# EasyEDA Pro project NFC1扩展板挖宝.eprj

# Board NFC1扩展板
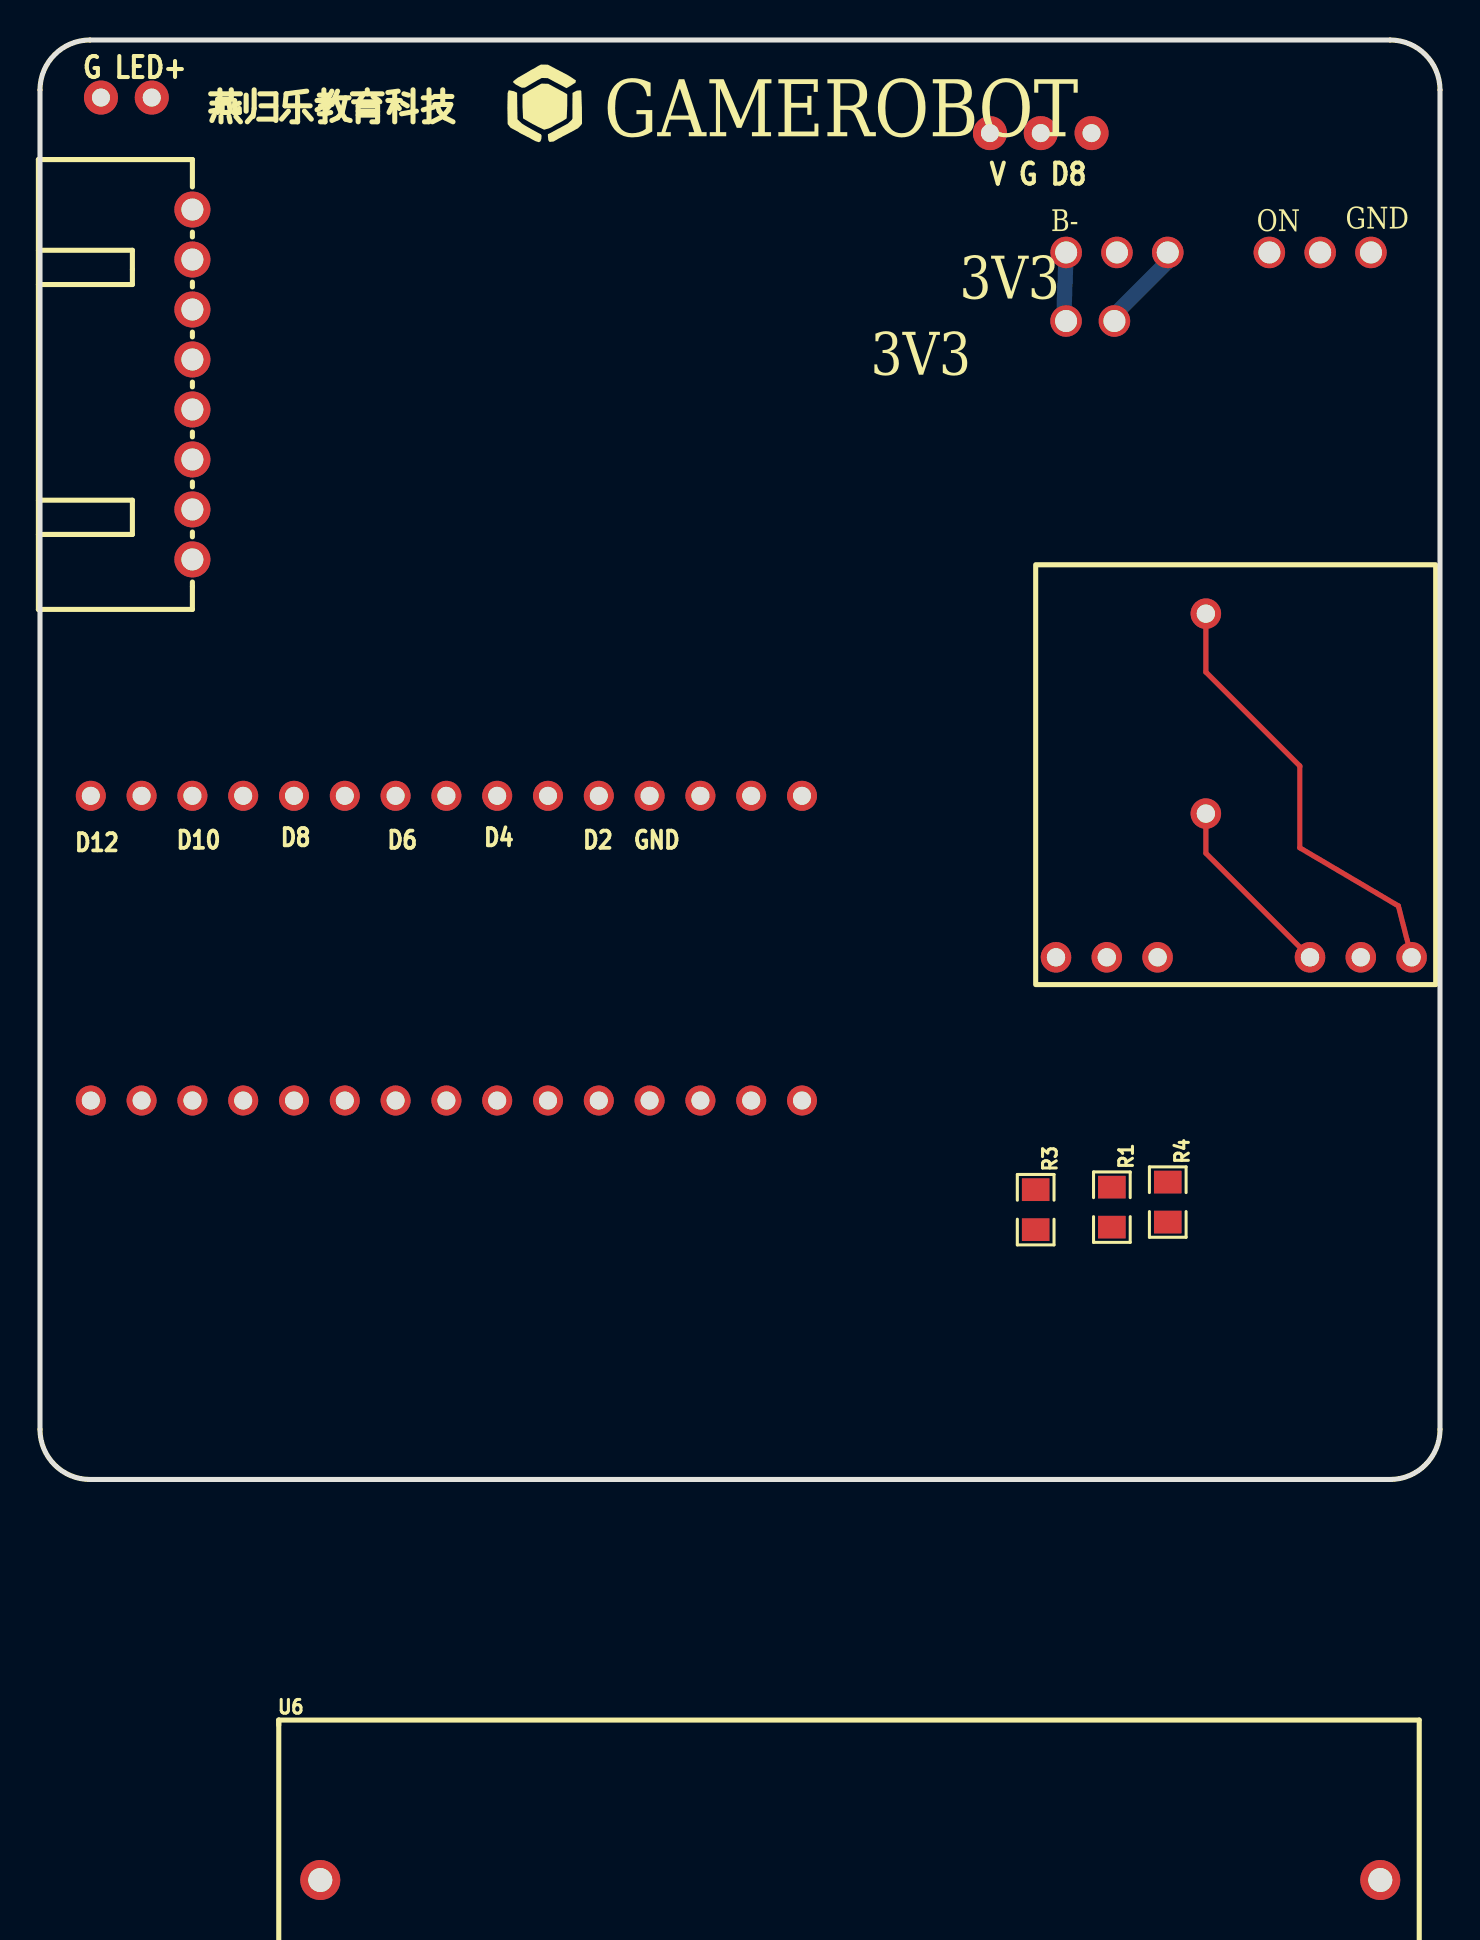
[diagram p0: board, top side]
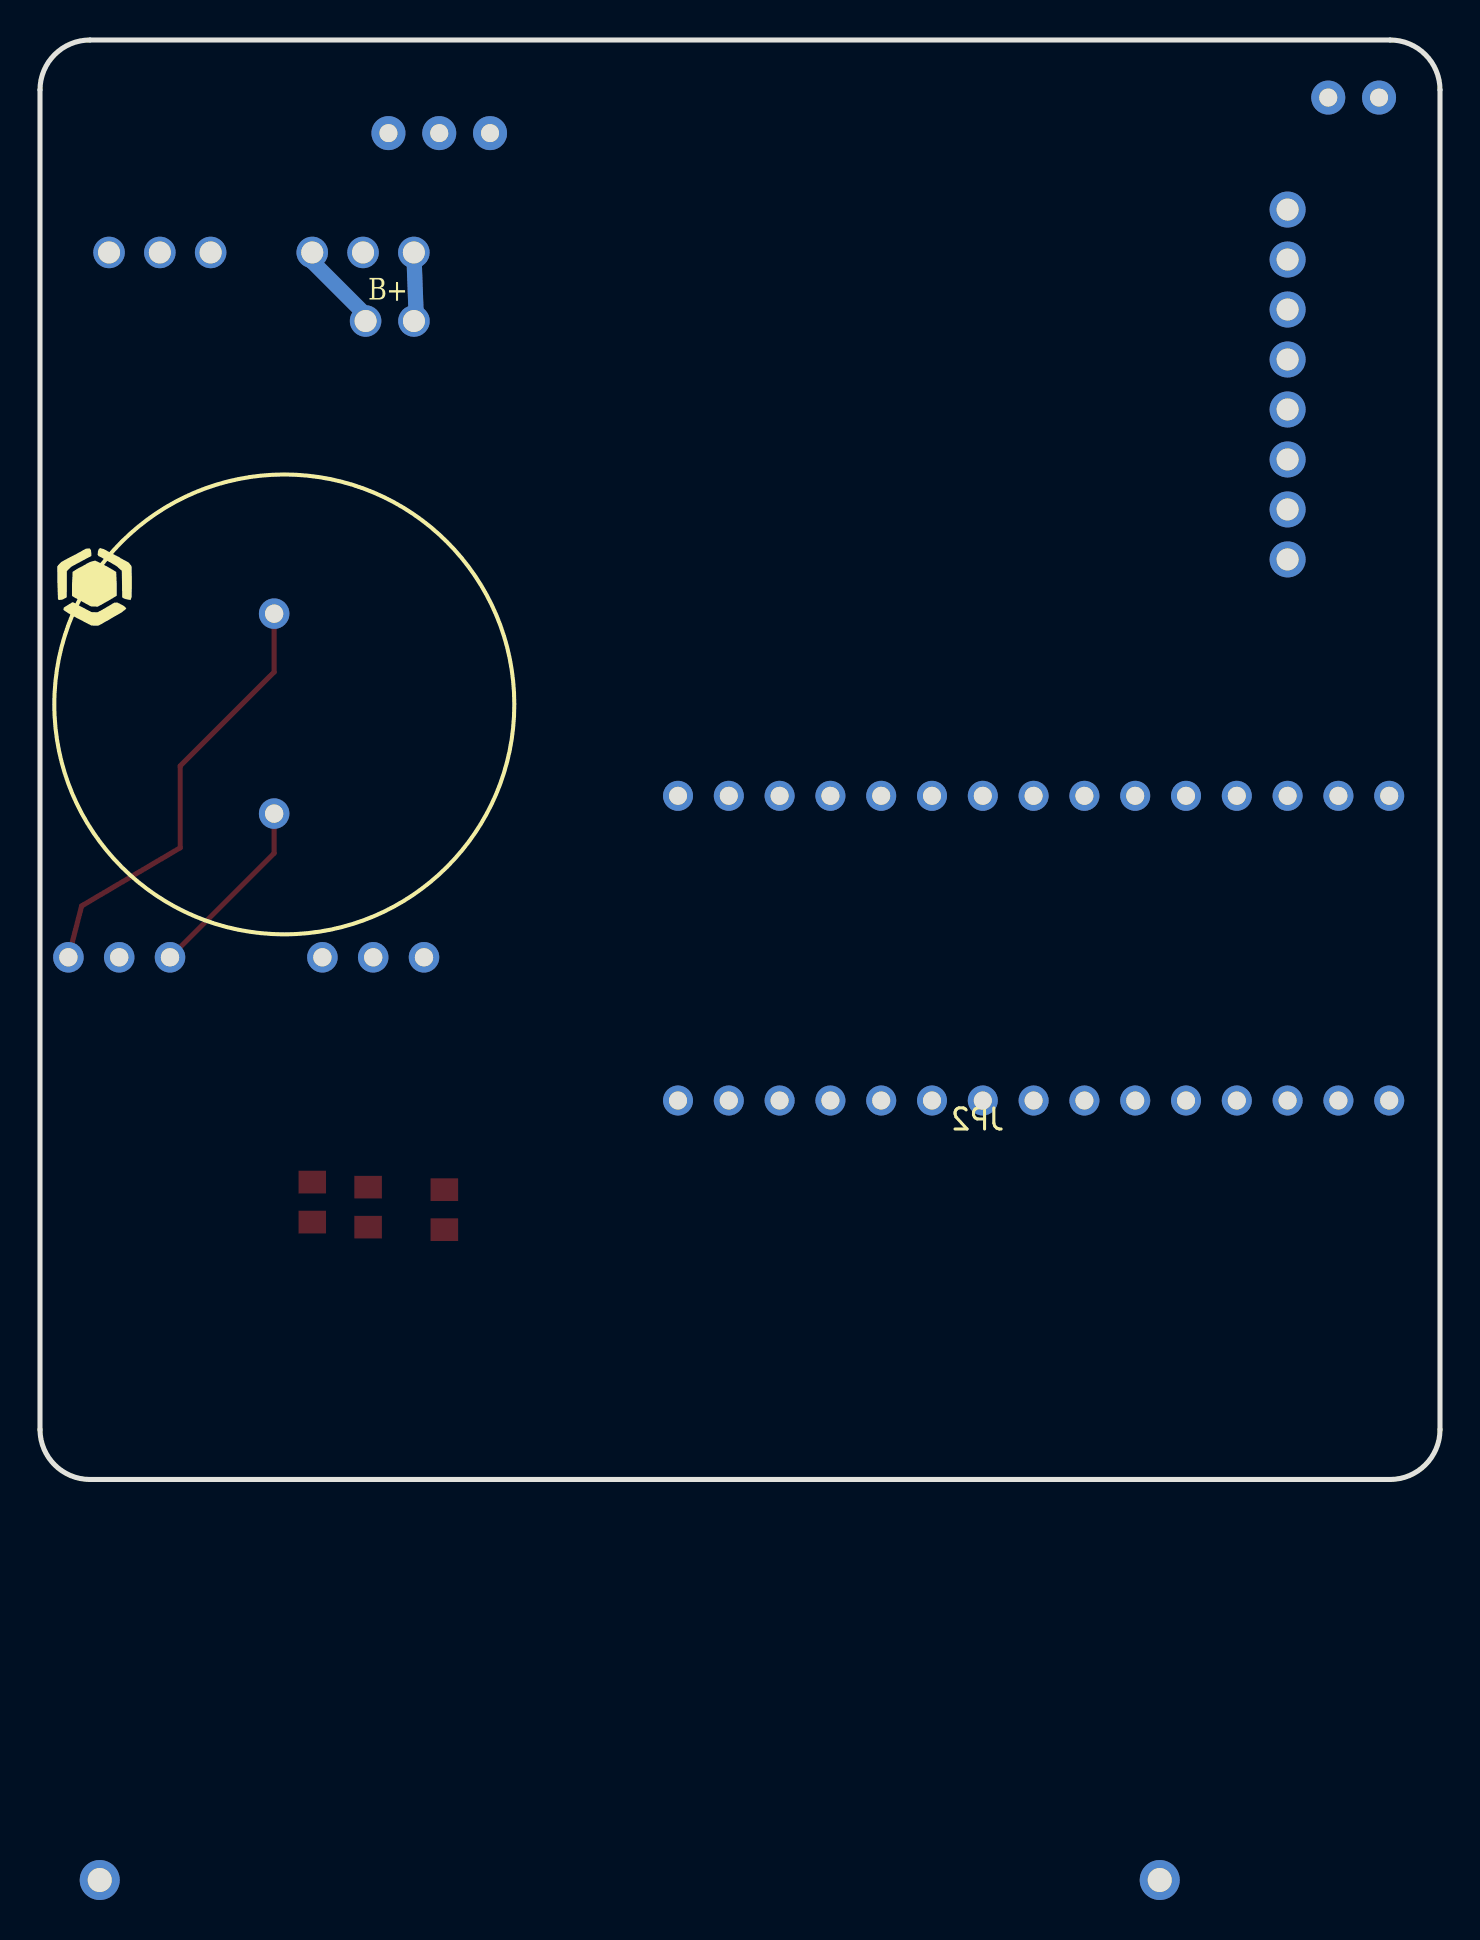
[diagram p1: board, bottom side, seen from below]

Outline 70 x 72 mm; copper layers: Top Layer, Bottom Layer. Coordinates in mm from the lower left corner of the outline.
Outline path: 0,69.5 0,2.5 arc(0.73,0.73) 2.5,0 67.5,0 arc(69.27,0.73) 70,2.5 70,69.5 arc(69.27,71.27) 67.5,72 2.5,72 arc(0.73,71.27) 0,69.5
Stack: Top Layer 0.0356mm / Dielectric1 0.32mm FR-4 er 4.8 / Bottom Layer 0.0356mm

## Design rules (mm)
template: 用户自定义配置
spacing Clearance (default): track to track 0.254, other pairs 0 to 0.254
track width Width (default): min 0.203, default 0.254, max 0.762
differential pair DiffPairsRouting (default): width min 0.381, default 0.381, max 0.381; gap min 0.254, default 0.254
via RoutingVias (default): diameter min 1.27, default 1.27, max 1.27; hole min 0.711, default 0.711, max 0.711

## Placement (name value [footprint] x y rotation side)
CN1  HX25003-8WAP  [CONN-TH_8P-P2.50_HX25003-8WAP]  7.62 54.77 270 top
JP2  Header-Male-2.54_1x15  [hdr-th_15p-p2.54-v-a]  20.32 18.95 180 top
JP3  Header-Male-2.54_1x15  [hdr-th_15p-p2.54-v-a]  20.32 34.19 180 top
NOREF  -  [Pad_ie26]  68.58 26.12 0 top
NOREF#2  -  [Pad_e81]  53.72 57.94 0 top
NOREF#3  -  [Pad_ie25]  66.04 26.12 0 top
NOREF#4  -  [Pad_e804]  64.01 61.37 0 top
NOREF#5  -  [Pad_ie16]  55.88 26.12 0 top
NOREF#6  -  [Pad_e811]  53.85 61.37 0 top
NOREF#7  -  [Pad_ie20]  63.5 26.12 0 top
NOREF#8  -  [Pad_e1]  47.5 67.34 0 top
NOREF#9  -  [Pad_e230]  58.29 43.31 270 top
NOREF#10  -  [Pad_e12]  52.58 67.34 0 top
NOREF#11  -  [Pad_ie15]  53.34 26.12 0 top
NOREF#12  -  [Pad_e76]  51.31 61.37 0 top
NOREF#13  -  [Pad_e73]  61.47 61.37 0 top
NOREF#14  -  [Pad_e232]  58.29 33.31 270 top
NOREF#15  -  [Pad_e82]  51.3 57.94 0 top
NOREF#16  -  [Pad_e9]  50.04 67.34 0 top
NOREF#17  -  [Pad_e423]  5.59 69.12 180 top
NOREF#18  -  [Pad_e75]  56.39 61.37 0 top
NOREF#19  -  [Pad_ie12]  50.8 26.12 0 top
NOREF#20  -  [Pad_e425]  3.05 69.12 180 top
NOREF#21  -  [Pad_e67]  66.55 61.37 0 top
R1  10K  [R0805]  53.59 13.62 270 top
R3  1K  [R0805]  49.78 13.49 270 top
R4  1K  [R0805]  56.39 13.88 270 top
U6  1节5号电池座带焊针  [BAT-TH_L57.0-W16.0-P53.00]  40.51 -20.03 0 top

## Footprints (pads in the part's own frame, mm; a bottom-side part is the same pattern mirrored in y, then rotated)
BAT-TH_L57.0-W16.0-P53.00
  round 2 hole 1.2: 1(-26.5,0) 2(26.5,0)
CONN-TH_8P-P2.50_HX25003-8WAP
  round 1.8 hole 1.1: 1(-8.75,0) 2(-6.25,0) 3(-3.75,0) 4(-1.25,0) 5(1.25,0) 6(3.75,0) 7(6.25,0) 8(8.75,0)
hdr-th_15p-p2.54-v-a
  round 1.5 hole 0.9: 1(-17.78,0) 2(-15.24,0) 3(-12.7,0) 4(-10.16,0) 5(-7.62,0) 6(-5.08,0) 7(-2.54,0) 8(0,0) 9(2.54,0) 10(5.08,0) 11(7.62,0) 12(10.16,0) 13(12.7,0) 14(15.24,0) 15(17.78,0)
Pad_e1
  round 1.7 hole 0.9: 21(0,0)
Pad_e9
  round 1.7 hole 0.9: 22(0,0)
Pad_e12
  round 1.7 hole 0.9: 23(0,0)
Pad_e67
  round 1.575 hole 1.1: 1(0,0)
Pad_e73
  round 1.575 hole 1.1: 3(0,0)
Pad_e75
  round 1.575 hole 1.1: 3(0,0)
Pad_e76
  round 1.575 hole 1.1: 3(0,0)
Pad_e81
  round 1.575 hole 1.1: 3(0,0)
Pad_e82
  round 1.575 hole 1.1: 3(0,0)
Pad_e230
  round 1.524 hole 0.914: 2(0,0)
Pad_e232
  round 1.524 hole 0.914: 1(0,0)
Pad_e423
  round 1.7 hole 0.9: 21(0,0)
Pad_e425
  round 1.7 hole 0.9: 21(0,0)
Pad_e804
  round 1.575 hole 1.1: 3(0,0)
Pad_e811
  round 1.575 hole 1.1: 3(0,0)
Pad_ie12
  round 1.524 hole 0.914: 12(0,0)
Pad_ie15
  round 1.524 hole 0.914: 12(0,0)
Pad_ie16
  round 1.524 hole 0.914: 12(0,0)
Pad_ie20
  round 1.524 hole 0.914: 12(0,0)
Pad_ie25
  round 1.524 hole 0.914: 11(0,0)
Pad_ie26
  round 1.524 hole 0.914: 11(0,0)
R0805
  rect 1.133x1.377 smd: 1(-1,0) 2(1,0)

## Nets
3V3: CN1.1 JP2.14
GND: CN1.3 JP2.2 JP3.4 NOREF#3.11 NOREF#16.22 NOREF#20.21 NOREF#21.1
VCC: JP2.4 NOREF#8.21 NOREF#19.12
VIN: JP2.1
A0: JP2.12
A1: JP2.11
A2: JP2.10
A3: JP2.9
A4/SDA: JP2.8
A5/SCL: JP2.7
A6: JP2.6
A7: JP2.5
AREF: JP2.13
B+: NOREF#2.3 NOREF#18.3
B-: NOREF#12.3 NOREF#15.3
D0/RX: JP3.2
D1/TX: JP3.1
D2: JP3.5 R1.2
D3: JP3.6 R3.1
D4: JP3.7 R4.1
D5: JP3.8
D6: JP3.9
D7: JP3.10
D8: JP3.11 NOREF#10.23
D9: CN1.2 JP3.12
D10/SS: CN1.8 JP3.13
D11/MOSI: CN1.6 JP3.14
D12/MISO: CN1.5 JP3.15
D13/SCK: CN1.7 JP2.15
LED+: NOREF#17.21 R3.2
ON: NOREF#13.3
RX1: NOREF#11.12 R1.1
SPK1: NOREF#7.12 NOREF#14.1
SPK2: NOREF.11 NOREF#9.2
TX2: NOREF#5.12 R4.2

Pads without a net: CN1 4; JP2 3; JP3 3; NOREF#4 3; NOREF#6 3; U6 1 2

## Routing (per net, layer and track width the routed paths; a pad name or vN(x,y) marks a point on that pad's centre or on a via; arc(x,y) is an arc through that point)
VCC: length 0.2
  Bottom Layer w0.254: 47.62,67.22 NOREF#8.21
B+: length 4.5
  Bottom Layer w0.762: NOREF#2.3 53.72,58.25 56.39,60.92 NOREF#18.3
B-: length 3.4
  Bottom Layer w0.762: NOREF#12.3 51.18,57.94
SPK1: length 9.3
  Top Layer w0.254: NOREF#7.12 58.29,31.33 NOREF#14.1
SPK2: length 22
  Top Layer w0.254: NOREF#9.2 58.29,40.39 62.99,35.69 62.99,31.59 67.92,28.69 NOREF.11

## Text on the board
Bottom Silkscreen Layer: B+
Top Silkscreen Layer: D12 | D10 | D8 | D6 | D4 | D2 | GND | V G D8 | G LED+ | 燕归乐教育科技 | GAMEROBOT | B- | ON | 3V3
